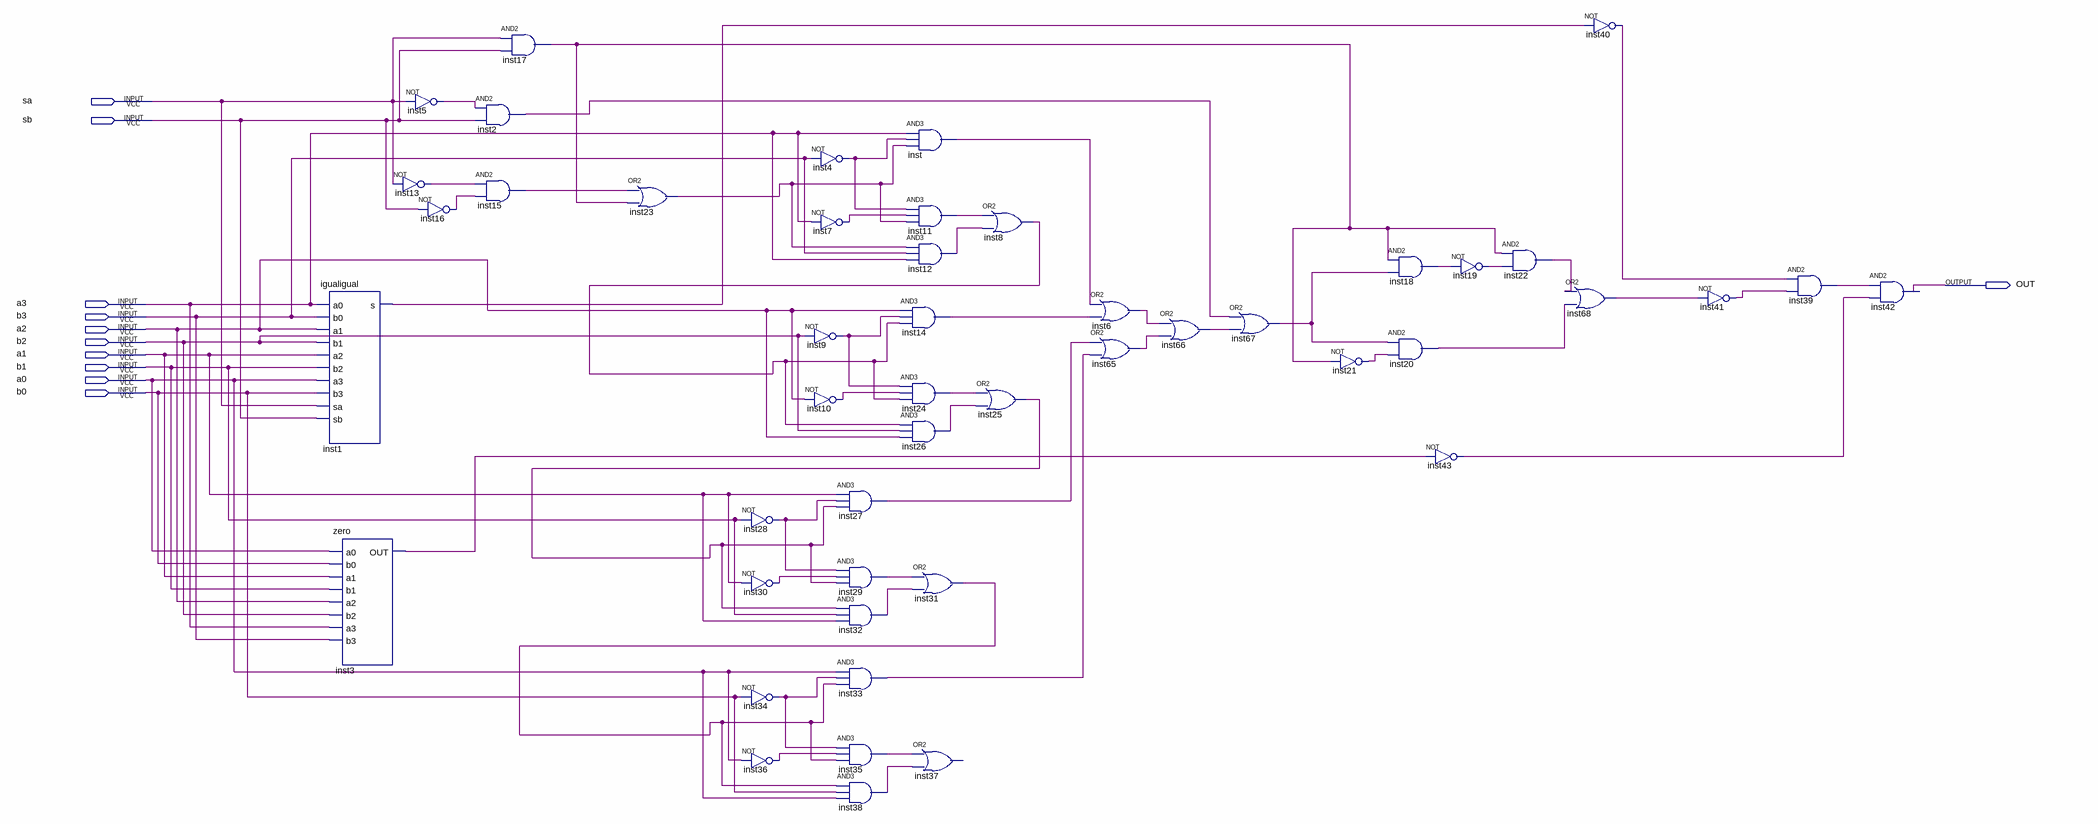
[diagram p0: schematic sheet]
// Quartus schematic menor_que.bdf as structural Verilog: 48 symbols, 11 pins
module menor_que (
  input  sa,
  input  sb,
  input  a3,
  input  b3,
  input  a2,
  input  b2,
  input  a1,
  input  b1,
  input  a0,
  input  b0,
  output OUT
);

  wire inst1_s, inst2_out, inst3_out, inst4_out, inst5_out, inst6_out, inst7_out, inst8_out, inst9_out,
       inst10_out, inst11_out, inst12_out, inst13_out, inst14_out, inst15_out, inst16_out, inst17_out,
       inst18_out, inst19_out, inst20_out, inst21_out, inst22_out, inst23_out, inst24_out, inst25_out,
       inst26_out, inst27_out, inst28_out, inst29_out, inst30_out, inst31_out, inst32_out, inst33_out,
       inst34_out, inst35_out, inst36_out, inst38_out, inst39_out, inst40_out, inst41_out, inst43_out,
       inst65_out, inst66_out, inst67_out, inst68_out, inst_out;

  igualigual inst1 (
    .a0(a3), .b0(b3), .a1(a2), .b1(b2), .a2(a1), .b2(b1), .a3(a0), .b3(b0), .sa(sa), .sb(sb), .s(inst1_s));
  zero inst3 (.a0(a0), .b0(b0), .a1(a1), .b1(b1), .a2(a2), .b2(b2), .a3(a3), .b3(b3), .OUT(inst3_out));
  not inst5 (inst5_out, sa);
  not inst13 (inst13_out, sa);
  not inst16 (inst16_out, sb);
  and inst2 (inst2_out, inst5_out, sb);
  and inst15 (inst15_out, inst13_out, inst16_out);
  and inst17 (inst17_out, sa, sb);
  or inst23 (inst23_out, inst15_out, inst17_out);
  not inst28 (inst28_out, b1);
  not inst30 (inst30_out, a1);
  not inst34 (inst34_out, b0);
  not inst36 (inst36_out, a0);
  not inst4 (inst4_out, b3);
  not inst7 (inst7_out, a3);
  not inst9 (inst9_out, b2);
  not inst10 (inst10_out, a2);
  and inst27 (inst27_out, a1, inst28_out, inst25_out);
  and inst29 (inst29_out, inst28_out, inst30_out, inst25_out);
  and inst32 (inst32_out, inst25_out, b1, a1);
  and inst33 (inst33_out, a0, inst34_out, inst31_out);
  and inst35 (inst35_out, inst34_out, inst36_out, inst31_out);
  and inst38 (inst38_out, inst31_out, b0, a0);
  and inst (inst_out, a3, inst4_out, inst23_out);
  and inst11 (inst11_out, inst4_out, inst7_out, inst23_out);
  and inst12 (inst12_out, inst23_out, b3, a3);
  and inst14 (inst14_out, a2, inst9_out, inst8_out);
  and inst24 (inst24_out, inst9_out, inst10_out, inst8_out);
  and inst26 (inst26_out, inst8_out, b2, a2);
  or inst31 (inst31_out, inst29_out, inst32_out);
  // OR2 inst37 has open pins: IN1=inst35_out, IN2=inst38_out, OUT=open
  or inst8 (inst8_out, inst11_out, inst12_out);
  or inst25 (inst25_out, inst24_out, inst26_out);
  or inst6 (inst6_out, inst_out, inst14_out);
  or inst65 (inst65_out, inst27_out, inst33_out);
  or inst66 (inst66_out, inst6_out, inst65_out);
  or inst67 (inst67_out, inst2_out, inst66_out);
  not inst21 (inst21_out, inst17_out);
  and inst18 (inst18_out, inst17_out, inst67_out);
  and inst20 (inst20_out, inst67_out, inst21_out);
  not inst43 (inst43_out, inst3_out);
  not inst19 (inst19_out, inst18_out);
  and inst22 (inst22_out, inst17_out, inst19_out);
  not inst40 (inst40_out, inst1_s);
  or inst68 (inst68_out, inst22_out, inst20_out);
  not inst41 (inst41_out, inst68_out);
  and inst39 (inst39_out, inst40_out, inst41_out);
  and inst42 (OUT, inst39_out, inst43_out);
endmodule
